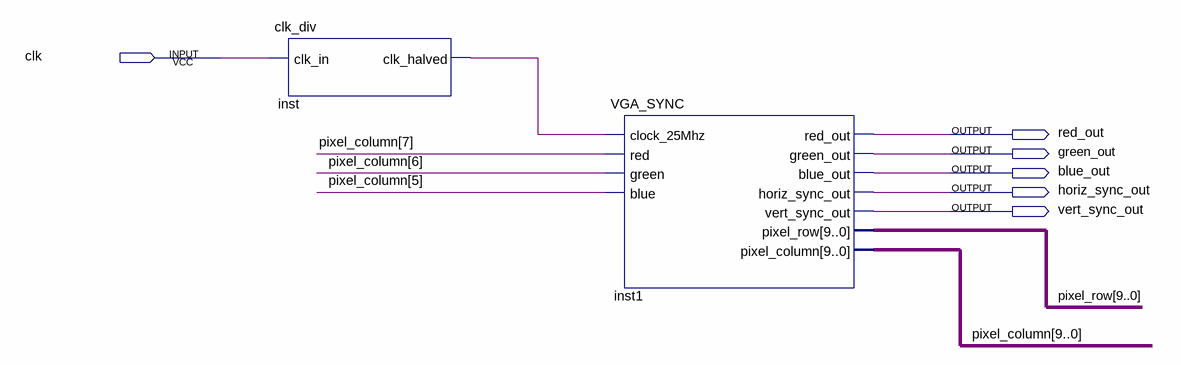
[diagram p0: schematic sheet]
// Quartus schematic Colour_bar_example.bdf as structural Verilog: 2 symbols, 6 pins
module Colour_bar_example (
  input  clk,
  output red_out,
  output green_out,
  output blue_out,
  output horiz_sync_out,
  output vert_sync_out
);

  wire inst_clk_halved;
  wire [9:0] pixel_column, pixel_row;

  clk_div inst (.clk_in(clk), .clk_halved(inst_clk_halved));
  VGA_SYNC inst1 (
    .clock_25Mhz(inst_clk_halved), .red(pixel_column[7]), .green(pixel_column[6]), .blue(pixel_column[5]),
    .red_out(red_out), .green_out(green_out), .blue_out(blue_out), .horiz_sync_out(horiz_sync_out),
    .vert_sync_out(vert_sync_out), .pixel_row(pixel_row), .pixel_column(pixel_column));
endmodule
